# Altium schematic sheet step-drive.SchDoc
size A
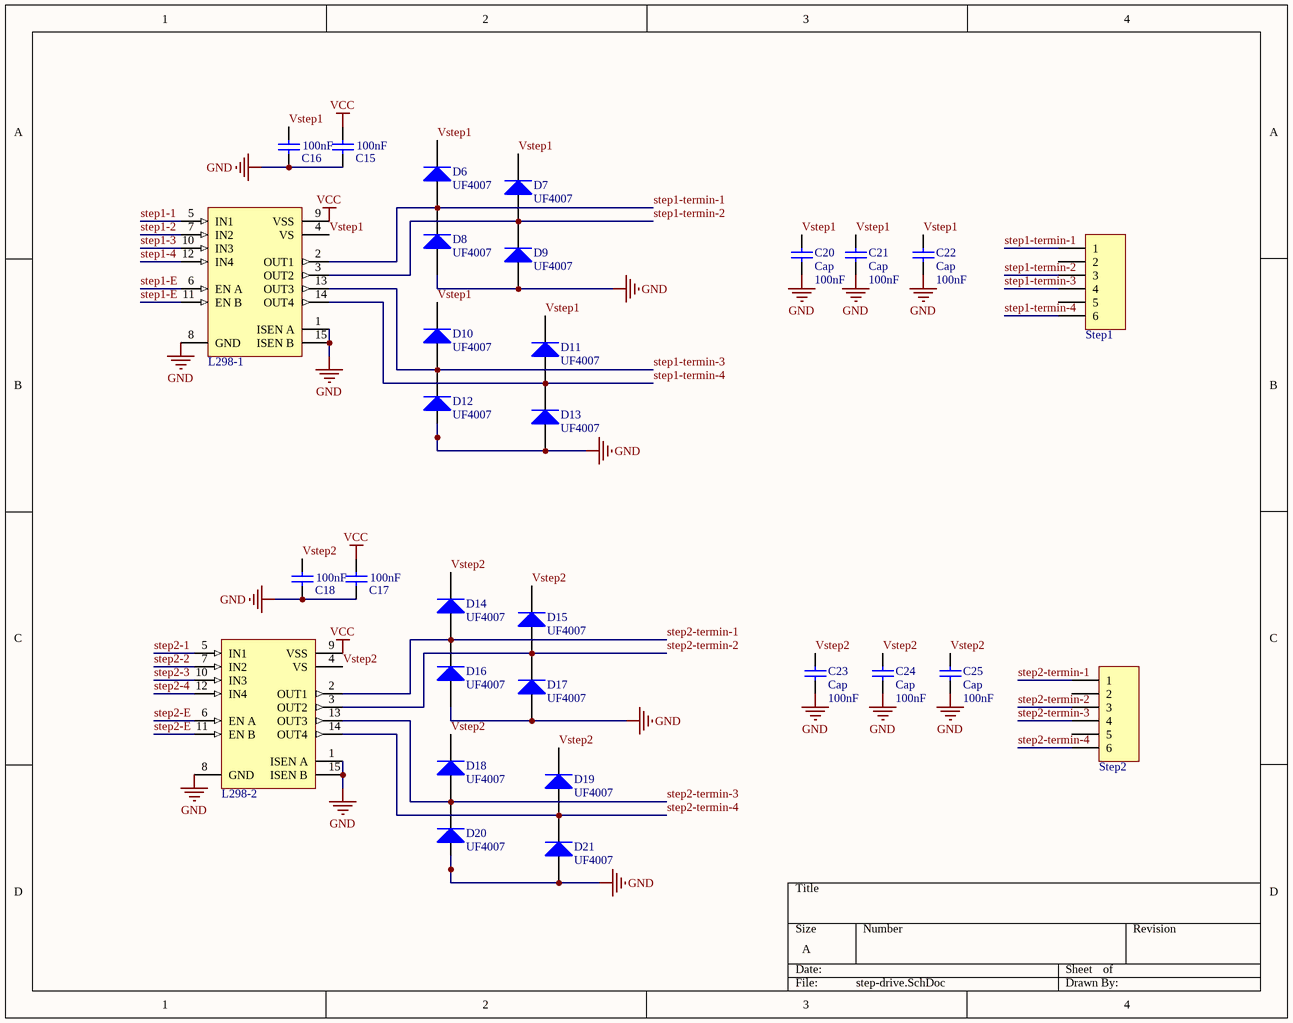
[diagram p0: step-drive.SchDoc]

## Parts
C15  100nF  [CAP 1206/3216 - 0.8MM]
C16  100nF  [CAP 1206/3216 - 0.8MM]
C17  100nF  [CAP 1206/3216 - 0.8MM]
C18  100nF  [CAP 1206/3216 - 0.8MM]
C20  Cap  value 100nF  [CAP 1206/3216 - 0.8MM]
C21  Cap  value 100nF  [CAP 1206/3216 - 0.8MM]
C22  Cap  value 100nF  [CAP 1206/3216 - 0.8MM]
C23  Cap  value 100nF  [CAP 1206/3216 - 0.8MM]
C24  Cap  value 100nF  [CAP 1206/3216 - 0.8MM]
C25  Cap  value 100nF  [CAP 1206/3216 - 0.8MM]
D6  UF4007  [DO214AC SMA]
D7  UF4007  [DO214AC SMA]
D8  UF4007  [DO214AC SMA]
D9  UF4007  [DO214AC SMA]
D10  UF4007  [DO214AC SMA]
D11  UF4007  [DO214AC SMA]
D12  UF4007  [DO214AC SMA]
D13  UF4007  [DO214AC SMA]
D14  UF4007  [DO214AC SMA]
D15  UF4007  [DO214AC SMA]
D16  UF4007  [DO214AC SMA]
D17  UF4007  [DO214AC SMA]
D18  UF4007  [DO214AC SMA]
D19  UF4007  [DO214AC SMA]
D20  UF4007  [DO214AC SMA]
D21  UF4007  [DO214AC SMA]
L298-1  L298  [L298]  (value not drawn)
L298-2  L298  [L298]  (value not drawn)
Step1  H-1x6  [H-1x6]  (value not drawn)
Step2  H-1x6  [H-1x6]  (value not drawn)

## Nets
GND: C15.1 C16.1 C17.1 C18.1 C20.2 C21.2 C22.2 C23.2 C24.2 C25.2 D8.1(A) D9.1(A) D12.1(A) D13.1(A) D16.1(A) D17.1(A) D20.1(A) D21.1(A) L298-1.1(ISEN_A) L298-1.8(GND) L298-1.15(ISEN_B) L298-2.1(ISEN_A) L298-2.8(GND) L298-2.15(ISEN_B)
VCC: C15.2 C17.2 L298-1.9(VSS) L298-2.9(VSS)
step1-1: L298-1.5(IN1)
step1-2: L298-1.7(IN2)
step1-3: L298-1.10(IN3)
step1-4: L298-1.12(IN4)
step1-E: L298-1.6(EN_A) L298-1.11(EN_B)
step1-termin-1: D6.1(A) D8.2(K) L298-1.2(OUT1) Step1.1
step1-termin-2: D7.1(A) D9.2(K) L298-1.3(OUT2) Step1.3
step1-termin-3: D10.1(A) D12.2(K) L298-1.13(OUT3) Step1.4
step1-termin-4: D11.1(A) D13.2(K) L298-1.14(OUT4) Step1.6
step2-1: L298-2.5(IN1)
step2-2: L298-2.7(IN2)
step2-3: L298-2.10(IN3)
step2-4: L298-2.12(IN4)
step2-E: L298-2.6(EN_A) L298-2.11(EN_B)
step2-termin-1: D14.1(A) D16.2(K) L298-2.2(OUT1) Step2.1
step2-termin-2: D15.1(A) D17.2(K) L298-2.3(OUT2) Step2.3
step2-termin-3: D18.1(A) D20.2(K) L298-2.13(OUT3) Step2.4
step2-termin-4: D19.1(A) D21.2(K) L298-2.14(OUT4) Step2.6
Vstep1: C16.2 C20.1 C21.1 C22.1 D6.2(K) D7.2(K) D10.2(K) D11.2(K) L298-1.4(VS)
Vstep2: C18.2 C23.1 C24.1 C25.1 D14.2(K) D15.2(K) D18.2(K) D19.2(K) L298-2.4(VS)

Not connected (* = marked no-connect by the designer): Step1 2 5; Step2 2 5

## Library data of the parts
C15-C18 C20-C25 = Cap ceramic: CAP-100Nf
  C15-C18: Value: 100nF
D6-D21 = Diode 1N4007: 1 Amp General Purpose Rectifier; Published: 8-Jun-2000; LatestRevisionDate: 17-Jul-2002; LatestRevisionNote: Re-released for DXP Platform.; DatasheetVersion: 1998; PackageVersion: Aug-1999; PackageReference: DO-41; Publisher: Altium Limited; PackageDescription: Diode, Axial; Body 5.2 x 2.7 mm (LxDia. max), Lead Dia. 0.86 mm (max); Code_JEDEC: DO-204-AL; ComponentLink1Description: Manufacturer Link; ComponentLink1URL: http://www.fairchildsemi.com/; ComponentLink2Description: Datasheet; ComponentLink2URL: http://www.fairchildsemi.com/ds/1N%2F1N4001.pdf